# Altium project PCB_EXT_CV_PRE1.PrjPcb
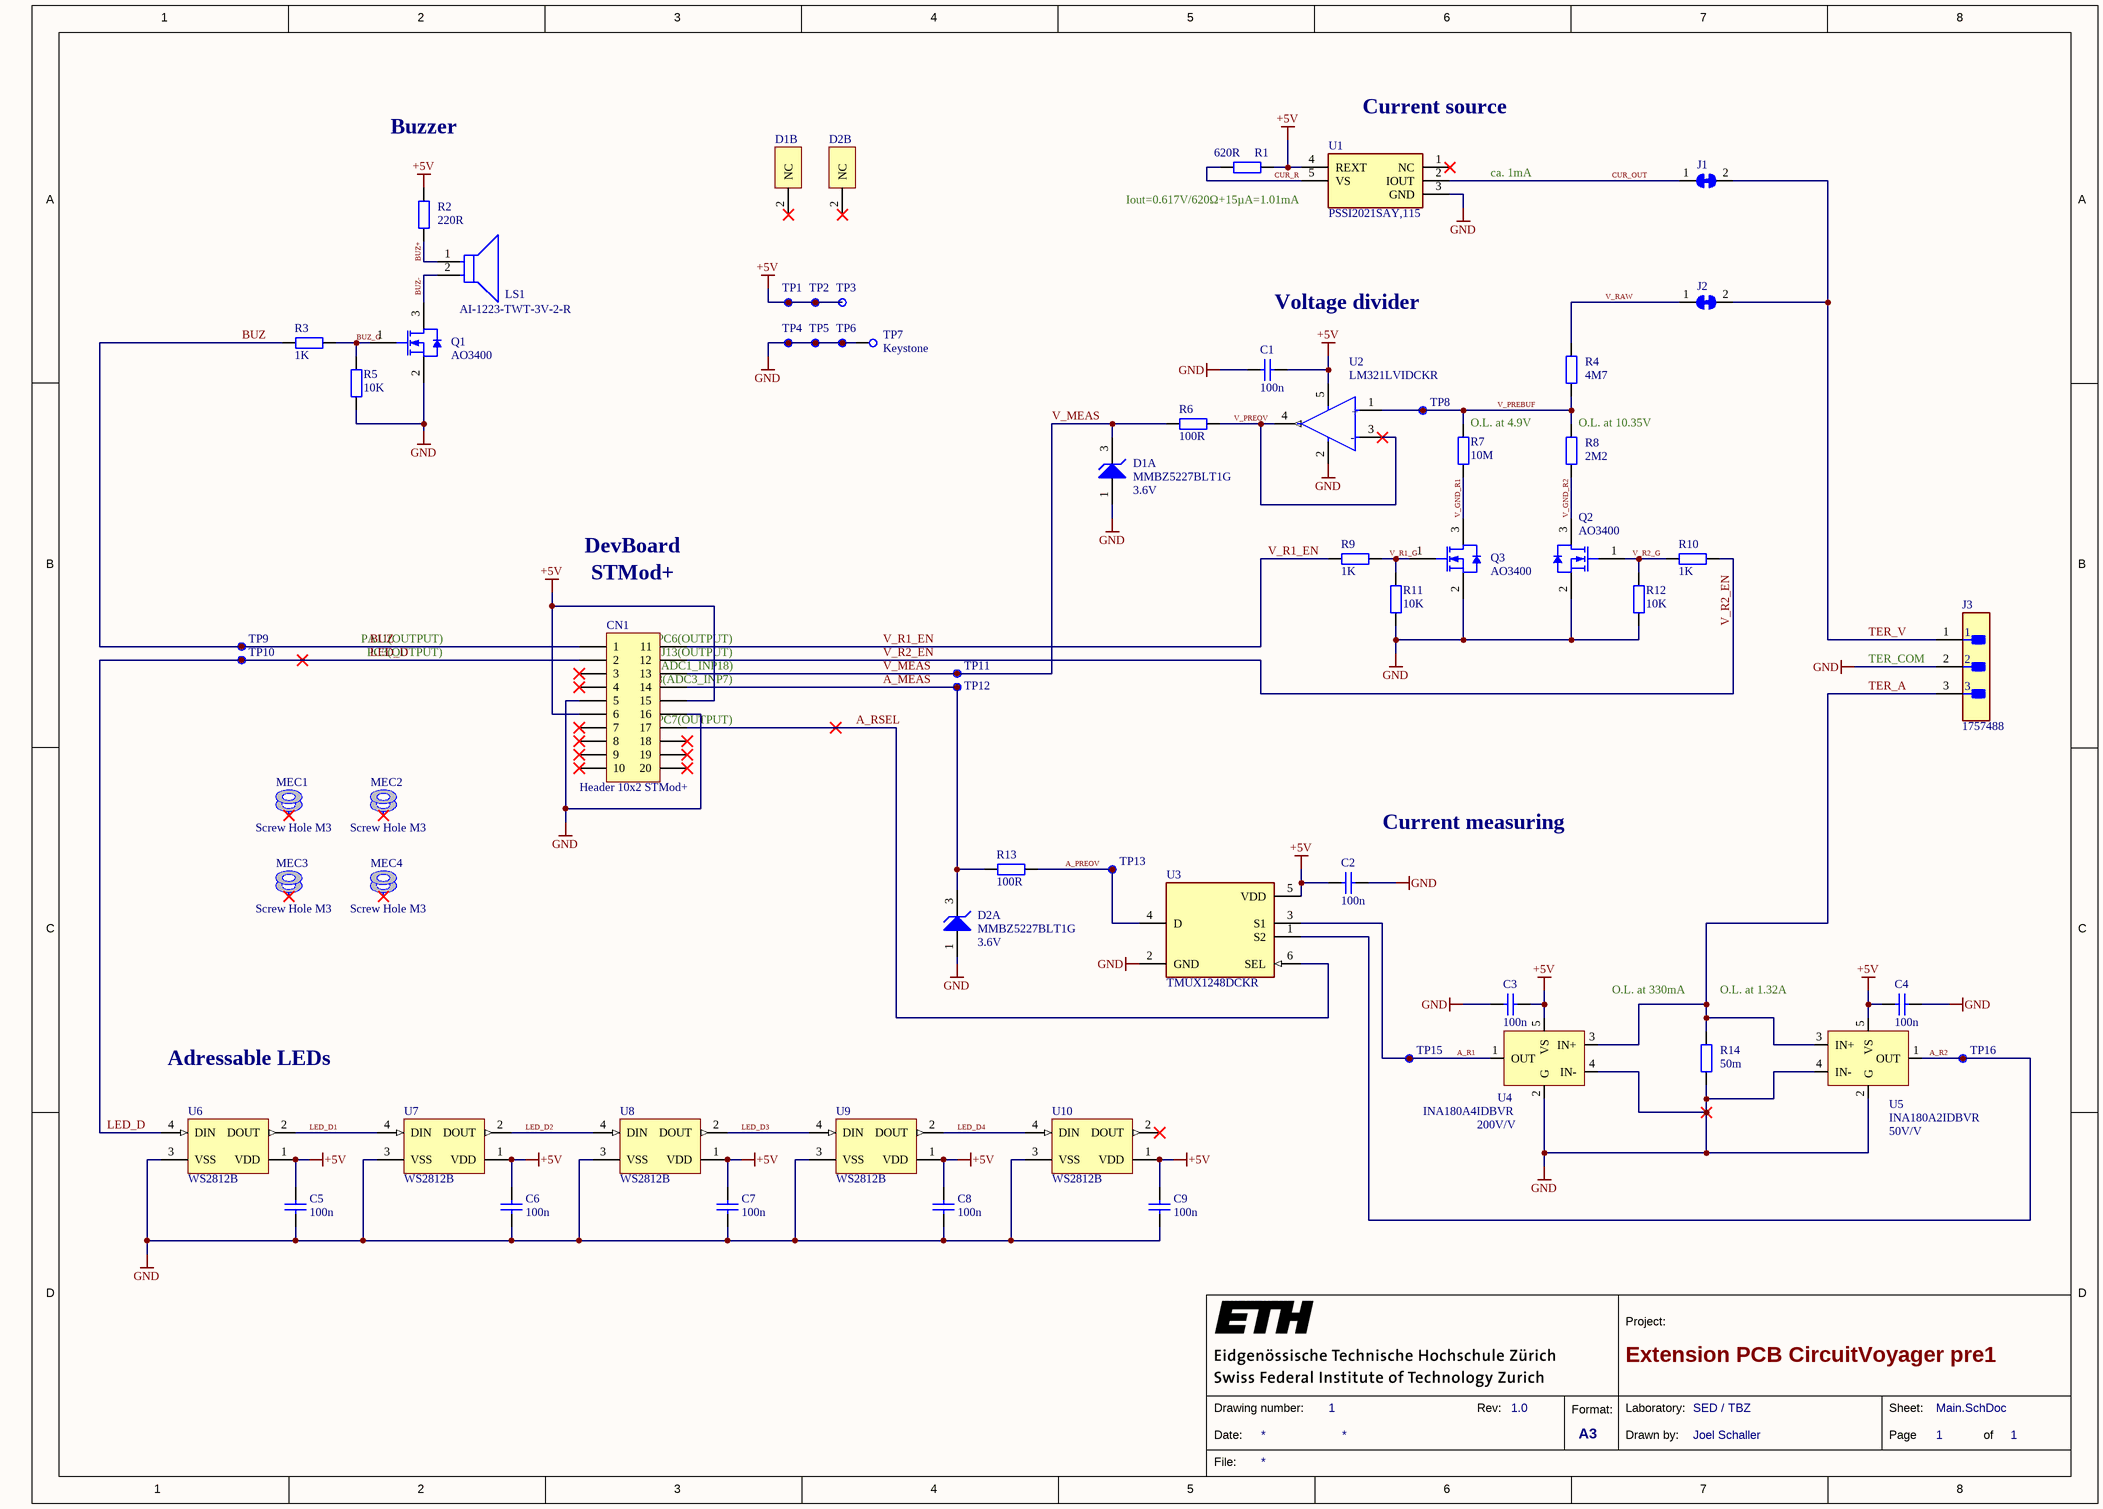
[diagram p0: Main.SchDoc]
Revision: 1.0
1 sheet, 62 parts. Net scope: global (net labels, ports and power ports of the same name join across sheets).
Board file: Main.PcbDoc

## Sheet Main.SchDoc: Extension PCB CircuitVoyager pre1
size A3; Author: Joel Schaller; DrawnBy: Joel Schaller; Organization: SED / TBZ; Address1: Joel Schaller; Address2: Im Chrummenacher 15; Address3: 8315 Lindau; Address4: joel.schaller16@gmail.com; DocumentNumber: 1; SheetNumber: 1; SheetTotal: 1

### Parts
C1  value 100n  [SMD_CAPC1005X06N]  (hidden comment: C0402)
C2  value 100n  [SMD_CAPC1005X06N]  (hidden comment: C0402)
C3  value 100n  [SMD_CAPC1005X06N]  (hidden comment: C0402)
C4  value 100n  [SMD_CAPC1005X06N]  (hidden comment: C0402)
C5  value 100n  [SMD_CAPC1005X06N]  (hidden comment: C0402)
C6  value 100n  [SMD_CAPC1005X06N]  (hidden comment: C0402)
C7  value 100n  [SMD_CAPC1005X06N]  (hidden comment: C0402)
C8  value 100n  [SMD_CAPC1005X06N]  (hidden comment: C0402)
C9  value 100n  [SMD_CAPC1005X06N]  (hidden comment: C0402)
CN1  Header 10x2 STMod+  [CON_SAMTEC_TMM-110-01-L-D-RA__STMOD+]
D1  MMBZ5227BLT1G  VZ Typ (V): 3.6V  [ONSC-SOT-23-3-318-08_V]  (parts A,B of 2)
D2  MMBZ5227BLT1G  VZ Typ (V): 3.6V  [ONSC-SOT-23-3-318-08_V]  (parts A,B of 2)
J1  SOLDERJUMPER_CLOSED_1MM  [SOLDERBRIDGE_CLOSED_1MM]  (value not drawn)  (net tie, no BOM)
J2  SOLDERJUMPER_CLOSED_1MM  [SOLDERBRIDGE_CLOSED_1MM]  (value not drawn)  (net tie, no BOM)
J3  1757488  [FP-1757488-MFG]
LS1  AI-1223-TWT-3V-2-R  [FP-AI-1223-TWT-3V-2-R-MFG]
MEC1  Screw Hole M3  [Screw M3 ISO 7380-1]  (no BOM)
MEC2  Screw Hole M3  [Screw M3 ISO 7380-1]  (no BOM)
MEC3  Screw Hole M3  [Screw M3 ISO 7380-1]  (no BOM)
MEC4  Screw Hole M3  [Screw M3 ISO 7380-1]  (no BOM)
Q1  AO3400  [AO-SOT23-3_V]
Q2  AO3400  [AO-SOT23-3_V]
Q3  AO3400  [AO-SOT23-3_V]
R1  value 620R  [SMD_RESC1005X04N]  (hidden comment: R0402)
R2  value 220R  [SMD_RESC1005X04N]  (hidden comment: R0402)
R3  value 1K  [SMD_RESC1005X04N]  (hidden comment: R0402)
R4  value 4M7  [SMD_RESC1005X04N]  (hidden comment: R0402)
R5  value 10K  [SMD_RESC1005X04N]  (hidden comment: R0402)
R6  value 100R  [SMD_RESC1005X04N]  (hidden comment: R0402)
R7  value 10M  [SMD_RESC1005X04N]  (hidden comment: R0402)
R8  value 2M2  [SMD_RESC1005X04N]  (hidden comment: R0402)
R9  value 1K  [SMD_RESC1005X04N]  (hidden comment: R0402)
R10  value 1K  [SMD_RESC1005X04N]  (hidden comment: R0402)
R11  value 10K  [SMD_RESC1005X04N]  (hidden comment: R0402)
R12  value 10K  [SMD_RESC1005X04N]  (hidden comment: R0402)
R13  value 100R  [SMD_RESC1005X04N]  (hidden comment: R0402)
R14  value 50m  [SMD_RESC2012X05N]  (hidden comment: R0805)
TP1  Test Point Small  [SMD_PAD_1mm]  (value not drawn)  (no BOM)
TP2  Test Point Small  [SMD_PAD_1mm]  (value not drawn)  (no BOM)
TP3  Test Point Small  [SMD_PAD_1mm]  (value not drawn)  (no BOM)
TP4  Test Point Small  [SMD_PAD_1mm]  (value not drawn)  (no BOM)
TP5  Test Point Small  [SMD_PAD_1mm]  (value not drawn)  (no BOM)
TP6  Test Point Small  [SMD_PAD_1mm]  (value not drawn)  (no BOM)
TP7  Keystone  [KEYSTONE_5019]
TP8  Test Point Small  [SMD_PAD_1mm]  (value not drawn)  (no BOM)
TP9  Test Point Small  [SMD_PAD_1mm]  (value not drawn)  (no BOM)
TP10  Test Point Small  [SMD_PAD_1mm]  (value not drawn)  (no BOM)
TP11  Test Point Small  [SMD_PAD_1mm]  (value not drawn)  (no BOM)
TP12  Test Point Small  [SMD_PAD_1mm]  (value not drawn)  (no BOM)
TP13  Test Point Small  [SMD_PAD_1mm]  (value not drawn)  (no BOM)
TP15  Test Point Small  [SMD_PAD_1mm]  (value not drawn)  (no BOM)
TP16  Test Point Small  [SMD_PAD_1mm]  (value not drawn)  (no BOM)
U1  PSSI2021SAY,115  [SOT65P210X100-5N]
U2  LM321LVIDCKR  [FP-DCK0005A-IPC_B]
U3  TMUX1248DCKR  [FP-DCK0006A-IPC_B]
U4  INA180A4IDBVR  value 200V/V  [FP-DBV0005A-IPC_B]
U5  INA180A2IDBVR  value 50V/V  [FP-DBV0005A-IPC_B]
U6  WS2812B  [ADAI-WS2812B_V]
U7  WS2812B  [ADAI-WS2812B_V]
U8  WS2812B  [ADAI-WS2812B_V]
U9  WS2812B  [ADAI-WS2812B_V]
U10  WS2812B  [ADAI-WS2812B_V]

### Nets
+5V: C1.1 C2.1 C3.1 C4.1 C5.2 C6.2 C7.2 C8.2 C9.2 CN1.6 CN1.15 R1.1 R2.2 TP1.1 TP2.1 TP3.1 U1.4(REXT) U2.5(V+) U3.5(VDD) U4.5(VS) U5.5(VS) U6.1(VDD) U7.1(VDD) U8.1(VDD) U9.1(VDD) U10.1(VDD)
GND: C1.2 C2.2 C3.2 C4.2 C5.1 C6.1 C7.1 C8.1 C9.1 CN1.5 CN1.16 D1.1(A) D2.1(A) J3.2 Q1.2(S) Q2.2(S) Q3.2(S) R5.1 R11.1 R12.1 R14.1 TP4.1 TP5.1 TP6.1 TP7.1 U1.3(GND) U2.2(V-) U3.2(GND) U4.2(G) U4.4(IN-) U5.2(G) U5.4(IN-) U6.3(VSS) U7.3(VSS) U8.3(VSS) U9.3(VSS) U10.3(VSS)
A_MEAS: CN1.14 D2.3(K) R13.1 TP12.1
A_PREOV: R13.2 TP13.1 U3.4(D)
A_R1: TP15.1 U3.3(S1) U4.1(OUT)
A_R2: TP16.1 U3.1(S2) U5.1(OUT)
A_RSEL: CN1.17 U3.6(SEL)
BUZ: CN1.1 R3.2 TP9.1
BUZ+: LS1.1(C) R2.1
BUZ-: LS1.2(A) Q1.3(D)
BUZ_G: Q1.1(G) R3.1 R5.2
CUR_OUT: J1.1 U1.2(IOUT)
CUR_R: R1.2 U1.5(VS)
LED_D: CN1.2 TP10.1 U6.4(DIN)
LED_D1: U6.2(DOUT) U7.4(DIN)
LED_D2: U7.2(DOUT) U8.4(DIN)
LED_D3: U8.2(DOUT) U9.4(DIN)
LED_D4: U9.2(DOUT) U10.4(DIN)
TER_A: J3.3 R14.2 U4.3(IN+) U5.3(IN+)
TER_V: J1.2 J2.2 J3.1
V_GND_R1: Q3.3(D) R7.1
V_GND_R2: Q2.3(D) R8.1
V_MEAS: CN1.13 D1.3(K) R6.1 TP11.1
V_PREBUF: R4.1 R7.2 R8.2 TP8.1 U2.1(IN+)
V_PREOV: R6.2 U2.3(IN-) U2.4(OUT)
V_R1_EN: CN1.11 R9.2
V_R1_G: Q3.1(G) R9.1 R11.2
V_R2_EN: CN1.12 R10.2
V_R2_G: Q2.1(G) R10.1 R12.2
V_RAW: J2.1 R4.2

Not connected (* = marked no-connect by the designer): CN1 3* 4* 7* 8* 9* 10* 18* 19* 20*; D1 2(NC)*; D2 2(NC)*; MEC1 1(2)*; MEC2 1(2)*; MEC3 1(2)*; MEC4 1(2)*; U1 1(NC)*; U10 2(DOUT)*

### Notes on the sheet
- Buzzer
- (near U1) Current source
- ca. 1mA
- Iout=0.617V/620Ω+15µA=1.01mA
- Voltage divider
- (near R7) O.L. at 4.9V
- (near R8) O.L. at 10.35V
- DevBoard
- STMod+
- PA11(OUTPUT)
- PC6(OUTPUT)
- PC3(OUTPUT)
- PJ13(OUTPUT)
- PA4(ADC1_INP18)
- PF8(ADC3_INP7)
- PC7(OUTPUT)
- (near J3) TER_COM
- Current measuring
- O.L. at 330mA
- O.L. at 1.32A
- Adressable LEDs
- 1
- 2
- 3
- 4
- 5
- 6
- 7
- 8
- A
- B
- C
- D
- Project:
- Date:
- Drawing number:
- Rev:
- Format:
- A3
- Drawn by:
- Laboratory:
- Page
- Sheet:
- of
- File:
- (in symbol CMP-04895-000147-1) +; -

### Library data of the parts
C1-C9 = CMP-02708-2: CERCAP 100n 16V 5% X7R 0402; Manufacturer: KEMET; Manufacturer Part Number: C0402C104J4RAC7867; Supplier: Digi-Key; Supplier Part Number: 399-C0402C104J4RAC7867CT-ND
CN1 = MCD-00288: Header 10x2, 2mm, RA, TH, Height 3.20mm/3.50mm,BF060-20A-B-0400-0280-0305-L-D; Part_Type: Connector; Manufacturer_Part_Number: TMM-110-01-L-D-RA; Manufacturer: SAMTEC; Alternate_Manufacturer_Part_Number: PH200210C-07000; Alternate_Manufacturer: JIUBABA; Part_Preference: Recommended; Provided_By: SUBCO; Component_Country_Of_Origin: China, Costa Rica, Malaysia, United States, Vietnam; ID: 2581; Order_Code_RS: 180-3469; ShowFields: YES; Internal_Part_Number: MCD-00288; Value: Header 10x2 STMod+; Status: Released; ComponentLink1Description: Datasheet; ComponentLink1URL: http://tunmcdsvn.tun.st.com/Component_Documentation_Library/Trunk/Connector/SAMTEC_TMM(TH)_Series/; ECCN_US: n/a; ECCN_EU: n/a; Order_Code_Digikey: SAM10228-ND; Order_Code_Farnell: 3515054
D1 D2 = CMP-1060-00983-1: Zener Voltage Regulator, 225 mW, 3-Pin SOT-23, Pb-Free, Tape and Reel; Manufacturer: On Semiconductor; ComponentLink1URL: http://www.onsemi.com/; ComponentLink1Description: Manufacturer URL; ComponentLink3Description: Package Specification; PackageDescription: 3-Pin Small Outline Transistor, Body 2.92 x 1.3 mm, Pitch 0.95 mm; RoHS: Pb-Free; PackageReference: SOT-23-3-318-08; Packing: Tape and Reel; PackageVersion: Rev. AP, 11/2009; PartNumber: MMBZ5227BLT1G; ComponentLink2Description: Datasheet; ComponentLink2URL: http://www.onsemi.cn/pub_link/Collateral/MMBZ5221BLT1-D.PDF; DatasheetVersion: Rev. 12; ComponentLink3URL: http://www.onsemi.cn/pub_link/Collateral/318-08.PDF; Mounting Technology: Surface Mount
J1 J2 = CMPL-001-0448-A.4: TP SOLDERJUMPER CLOSED 1mm
J3 = CMP-09399-000001-1: TERM BLOCK HDR 3POS 90DEG 5MM; Manufacturer: Phoenix Contact; Current Rating: 12A; Voltage Rating: 320V; Conn Gender: Male; Conn Orientation: Right Angle; Number Of Contacts: 3; Lead Free: Yes; Octopart: https://octopart.com/1757488-phoenix+contact-37691; Device Class L2: Headers and Wire Housings; Automotive: No; ComponentLink2URL: https://www.phoenixcontact.com/online/portal/us/?uri=pxc-oc-itemdetail:pid=1757488&library=usen&pcck=P-11-02-11&tab=1&selectedCategory=ALL#drawings; Device Class L3: unset; ComponentLink2Description: Datasheet; Pitch: 5mm; Number Of Rows: 1; RoHS: TRUE; Manufacturer Part Number: 1757488; Height: 8.75mm; Footprint Url: https://www.phoenixcontact.com/online/portal/us/pxc/product_detail_page/!ut/p/z1/5Vdbc6IwFP4r9sG3jQkQLj4idZWqrRZdlRcmhOiky62Atttfv4l13eq0-tDxCSYDuZzznXwn-TIE-nAB_ZRs-ZpUPEtJLNpL3wimnWm3O1YN5WGid5B7qzvdIX5U-vcq_AV96JcsZrRikUMqts6KP3BpD4dyoCIhXCqyllP6Gy7HQFEAUsVb9sU8LIi03pQs3RnxSJibuoktS7az1dhxBqduFa9iJjoLnoqYgPKCbnjVCDNSRA2apamYS1Y0QGPkTTt2Q_2hN1FDAz3R8w97fpaWLcKcZ_3uj754bHTJfyn8zUDtKUjpY2XUm47aaDLrjyY_J-3HiWdC79P8_E9nwSjjW1YIJJm3Ios2tLplFeFx6VYscY8T-eUCnWY8j1ZJFrE9bFZyuQ-Ogoj2lL1W-75PVlVAxCRdb8hawpxnquLaMDVqw1SvDdPa6NStjU7d2ujUrY1O3dro1K7N7rVrcyLZmmC67AiG-lO-nsA76PMwab3QpIVa-Stt7YMG0Y5akEvQuXOwn8uAF_52dwZnfmc9lgYzLxgvnJl3YbqWBudbzl7gLM2KRFwhvPckyCRGyEIMIxOQSNUBNlUGCGpTEKI2thjGKxXpsI8uRHhA34xwAV69Kjy-LvzguskZKFeFd747-7uzW32I5YWWPz0_-zb0xVWxkipdyKOjiV5Y2EQJ4aK6V1TZRDEvq52iRD2nYXC4XpZBflB0E0VUt0ximCDUMQLYMAxAVIQBY5oaGitT0doWzJPE0vYFzBZvUxa-fSyrD-PvJbi_17dHBZBjHxZaSDtx0_PtidsVQwG_7YKeE1qjrqavk-DkU9o3N38BJx0ofA!!/p0/IZ7_2G101H41MGTM90QUHMQFQ9RQI5=CZ6_TBTEEP261OQ5B0ID5CEL4R1HN2=LA0=EdownloadId!6315992=action!downlo; Category: Conn; Contact Material: Tin; Mouser Description: Pluggable Terminal Blocks 3 Pos 5mm pitch Through Hole Header; Device Class L1: Connectors; Digikey Description: TERM BLOCK HDR 3POS 90DEG 5MM; Package: 0
LS1 = CMP-103888-000003-1: BUZZER MAGNETIC 3V 12MM TH; Min Supply Voltage (DC): 2V; Operating Supply Current: 30mA; Max Supply Voltage (DC): 4V; Input Type: DC; Frequency: 2.3kHz; Series: AI; Nominal Supply Voltage (DC): 3V; Packaging: Tray; Max Operating Temperature: 70°C; Height: 7.5mm; Termination: PC Pins; Max Supply Current: 30mA; Mount: Through Hole; Diameter: 12mm; Voltage Rating: 3V; Sensing Method: Magnetic; Min Operating Temperature: -20°C; Contact Plating: Tin
MEC1-MEC4 = CMPL-001-0477-A.6: EMECH Generic Screw Hole - different sizes
Q1-Q3 = CMP-0278-00001-1: N-channel Enhancement Mode Field-Effect Transistor; 5.8A/30V; Manufacturer: Alpha and Omega; Channel Type: N; Drain-Source Voltage Limit: 30 V; Junction Temperature: -55 to 150 degC; Gate-Source Voltage Limit: +/-12 V; PackageDescription: 3-Pin SOT23, 3.016 x 2.8 mm Body, 0.95 mm Pitch; ComponentLink2Description: Datasheet; DatasheetVersion: Rev.8, 12/2011; ComponentLink3URL: http://www.aosmd.com/res/packaging_information/SOT-23.pdf; Storage Temperature: -55 to 150 degC; ComponentLink3Description: Package Specification; PackageReference: SOT23; ComponentLink1Description: Manufacturer URL; Mounting Technology: Surface Mount; ComponentLink1URL: http://www.aosmd.com/; PartNumber: AO3400; ComponentLink2URL: http://www.aosmd.com/res/data_sheets/AO3400.pdf
R1 = CMP-01484-1: RES 620R 62.5mW 1% 0402; Manufacturer: YAEGO; Manufacturer Part Number: RC0402FR-07620RL; Manufacturer2 Part Number: CRCW0402620RFKED; Manufacturer2: Vishay Dale; Supplier: Digi-Key; Supplier Part Number: 311-620LRCT-ND; Supplier2: Digi-Key; Supplier2 Part Number: 541-620LCT-ND
R2 = CMP-01473-1: RES 220R 62.5mW 1% 0402; Manufacturer: YAEGO; Manufacturer Part Number: RC0402FR-07220RL; Manufacturer2 Part Number: CRCW0402220RFKED; Manufacturer2: Vishay Dale; Supplier: Digi-Key; Supplier Part Number: 311-220LRCT-ND; Supplier2: Digi-Key; Supplier2 Part Number: 541-220LCT-ND
R3 R9 R10 = CMP-01489-1: RES 1K 62.5mW 1% 0402; Manufacturer: YAEGO; Manufacturer Part Number: RC0402FR-071KL; Manufacturer2 Part Number: CRCW04021K00FKED; Manufacturer2: Vishay Dale; Supplier: Digi-Key; Supplier Part Number: 311-1.00KLRCT-ND; Supplier2: Digi-Key; Supplier2 Part Number: 541-1.00KLCT-ND
R4 = CMP-01577-1: RES 4M7 62.5mW 1% 0402; Manufacturer: YAEGO; Manufacturer Part Number: RC0402FR-074M7L; Manufacturer2 Part Number: CRCW04024M70FKED; Manufacturer2: Vishay Dale; Supplier: Digi-Key; Supplier Part Number: 13-RC0402FR-074M7LCT-ND; Supplier2: Digi-Key; Supplier2 Part Number: 541-4.70MLCT-ND
R5 R11 R12 = CMP-01513-1: RES 10K 62.5mW 1% 0402; Manufacturer: YAEGO; Manufacturer Part Number: RC0402FR-0710KL; Manufacturer2 Part Number: CRCW040210K0FKED; Manufacturer2: Vishay Dale; Supplier: Digi-Key; Supplier Part Number: 311-10.0KLRCT-ND; Supplier2: Digi-Key; Supplier2 Part Number: 541-10.0KLCT-ND
R6 R13 = CMP-01465-1: RES 100R 62.5mW 1% 0402; Manufacturer: YAEGO; Manufacturer Part Number: RC0402FR-07100RL; Manufacturer2 Part Number: CRCW0402100RFKED; Manufacturer2: Vishay Dale; Supplier: Digi-Key; Supplier Part Number: 311-100LRCT-ND; Supplier2: Digi-Key; Supplier2 Part Number: 541-100LCT-ND
R7 = CMP-01585-1: RES 10M 62.5mW 1% 0402; Manufacturer: YAEGO; Manufacturer Part Number: RC0402FR-0710ML; Manufacturer2 Part Number: CRCW040210M0FKED; Manufacturer2: Vishay Dale; Supplier: Digi-Key; Supplier Part Number: 311-10.0MLRCT-ND; Supplier2: Digi-Key; Supplier2 Part Number: 541-10.0MLCT-ND
R8 = CMP-01569-1: RES 2M2 62.5mW 1% 0402; Manufacturer: YAEGO; Manufacturer Part Number: RC0402FR-072M2L; Manufacturer2 Part Number: CRCW04022M20FKED; Manufacturer2: Vishay Dale; Supplier: Digi-Key; Supplier Part Number: 13-RC0402FR-072M2LCT-ND; Supplier2: Digi-Key; Supplier2 Part Number: 541-2.20MLCT-ND
R14 = CMPL-001-0286-A.2: RES 0R05 125mW 1% 0805
TP1-TP6 TP8-TP13 TP15 TP16 = CMP-02902-2: TP TESTPOINT MULTIPLE_SIZE
TP7 = CMPL-001-0505-7: TP SMD 3.81x 2.03mm; Manufacturer: Keystone Electronics; Manufacturer Part Number: 5019; Design Item ID: 5019; Source: 5019.SchLib; Supplier: Digi-Key; Supplier Part Number: 36-5019CT-ND
U1 = PSSI2021SAY_115: NEXPERIA - PSSI2021SAY,115 - IC, CURRENT SOURCE, 50MA, 75V,SOT353; Geometry.Height: 1mm; Manufacturer_Name: Nexperia; Manufacturer_Part_Number: PSSI2021SAY,115; Mouser Part Number: 771-PSSI2021SAY-T/R; Mouser Price/Stock: https://www.mouser.co.uk/ProductDetail/Nexperia/PSSI2021SAY115?qs=LOCUfHb8d9uGmlRc%2FuHP%2FA%3D%3D; Arrow Part Number: PSSI2021SAY,115; Arrow Price/Stock: https://www.arrow.com/en/products/pssi2021say115/nexperia?region=europe; Datasheet Link: https://assets.nexperia.com/documents/data-sheet/PSSI2021SAY.pdf
U2 = CMP-04895-000147-1: IC OPAMP GP 1 CIRCUIT SC70-5; RoHS Compliant: Yes
U3 = CMP-04892-000117-1: 3- LOW RON, 5-V, 2:1 (SPDT) GENE
U4 = CMP-014-00002-1: Operational Amplifier, 1 Func, 500uV Offset-Max, PDSO5; Common-mode Reject Ratio-Nom: 100dB; Channels: 1; Slew Rate: 2V/µs; Nominal Supply Voltage: 5V; Supply Voltage Limit-Max: 6V; Unity Gain BW-Nom: 350kHz; Package Body Material: Plastic; Moisture Sensitivity Level: 1; Input Offset Voltage-Max: 500uV; Package Shape: Rectangular; Width: 1.6mm; Length: 2.9mm; Surface Mount: Yes; Temperature Grade: AUTOMOTIVE; Pins: 5; Case/Package: LSSOP; Height - Seated (Max): 1.45mm; Amplifier Type: OPERATIONAL AMPLIFIER; JESD-609 Code: e3; Max Operating Temperature: 125°C; Terminal Finish: Tin; RoHS Compliant: Yes; Min Operating Temperature: -40°C; Package Style: SMALL OUTLINE, LOW PROFILE, SHRINK PITCHMeter; JESD-30 Code: R-PDSO-G5; Terminal Position: DUAL; Reach SVHC Compliant: Yes; Peak Reflow Temperature (Cel): 260°C; Terminal Pitch: 0.95mm; Terminal Form: Gull Wing
U5 = CMP-014-00003-1: Operational Amplifier, 1 Func, 500uV Offset-Max, PDSO5; Nominal Supply Voltage: 5V; Supply Voltage Limit-Max: 6V; Package Body Material: Plastic; Slew Rate: 2V/µs; Common-mode Reject Ratio-Nom: 100dB; Channels: 1; Unity Gain BW-Nom: 350kHz; Width: 1.6mm; Min Operating Temperature: -40°C; Terminal Position: DUAL; Peak Reflow Temperature (Cel): 260°C; Surface Mount: Yes; Temperature Grade: AUTOMOTIVE; Terminal Form: Gull Wing; JESD-609 Code: e3; Length: 2.9mm; Package Shape: Rectangular; Max Operating Temperature: 125°C; Height - Seated (Max): 1.45mm; RoHS Compliant: Yes; Amplifier Type: OPERATIONAL AMPLIFIER; Case/Package: LSSOP; Package Style: SMALL OUTLINE, LOW PROFILE, SHRINK PITCHMeter; Terminal Finish: Tin; Pins: 5; JESD-30 Code: R-PDSO-G5; Input Offset Voltage-Max: 500uV; Reach SVHC Compliant: Yes; Terminal Pitch: 0.95mm; Moisture Sensitivity Level: 1
U6-U10 = CMP-007-00035-2: Intelligent Control LED Integrated Light Source, 3.5 to 5.3 V, -25 to 80 degC, 4-Pin SMD, RoHS, Bulk; Manufacturer: Adafruit Industries; Datasheet URL: https://cdn-shop.adafruit.com/datasheets/WS2812B.pdf; Manufacturer URL: https://www.adafruit.com/; Datasheet Version: May-13; Case/Package: WS2812B; Mounting Technology: SM; RoHS Compliant: False; Package Description: 4-Pin Surface Mount Device, Body 5 x 5 mm, Pitch 3.3 mm; Package Reference: WS2812B